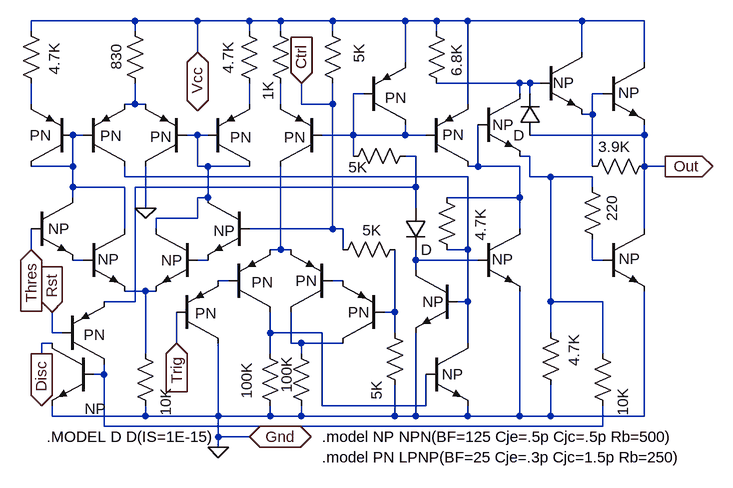
[diagram p0: schematic lm555.asc]
lm555.asc, the LTspice schematic file:
Version 4
SHEET 1 984 680
WIRE -96 144 -32 144
WIRE -32 144 -32 96
WIRE 64 16 64 48
WIRE 64 48 48 48
WIRE 64 48 80 48
WIRE -96 48 -96 16
WIRE -16 96 -32 96
WIRE 80 208 80 144
WIRE 240 48 240 16
WIRE 176 96 160 96
WIRE 160 96 160 144
WIRE 160 96 144 96
WIRE 160 144 176 144
WIRE 240 -80 160 -80
WIRE -96 -64 -96 -80
WIRE 64 -64 64 -80
WIRE 64 -80 -96 -80
WIRE 240 -64 240 -80
WIRE -32 192 -32 176
WIRE -16 288 -32 288
WIRE 48 240 48 176
WIRE 48 176 -32 176
WIRE -32 176 -32 144
WIRE 176 192 176 144
WIRE 176 144 240 144
WIRE 176 288 160 288
WIRE 96 336 80 336
WIRE 96 240 96 224
WIRE 96 224 160 224
WIRE 160 224 160 192
WIRE 160 192 176 192
WIRE 288 48 288 16
WIRE 288 -64 288 -80
WIRE 288 -80 240 -80
WIRE 240 240 368 240
WIRE 368 240 368 48
WIRE 208 320 192 320
WIRE 272 272 288 272
WIRE 288 144 288 272
WIRE 288 272 304 272
WIRE 368 320 384 320
WIRE 384 416 320 416
WIRE 304 416 304 368
WIRE 272 432 272 400
WIRE 320 432 320 416
WIRE 320 416 304 416
WIRE 192 416 192 528
WIRE 272 512 272 528
WIRE 272 528 320 528
WIRE 320 528 320 512
WIRE 272 528 192 528
WIRE 192 528 192 560
WIRE 384 272 384 240
WIRE 384 240 368 240
WIRE 464 272 464 368
WIRE 464 368 448 368
WIRE 464 400 464 368
WIRE 464 480 464 528
WIRE 464 528 320 528
WIRE 368 -64 368 -80
WIRE 368 -80 288 -80
WIRE 80 432 80 336
WIRE 80 336 48 336
WIRE 80 512 80 528
WIRE 80 528 192 528
WIRE 0 464 16 464
WIRE 16 464 16 448
WIRE -64 512 -64 528
WIRE -64 528 80 528
WIRE 272 400 352 400
WIRE 272 400 272 368
WIRE 352 400 352 512
WIRE 352 512 512 512
WIRE 512 512 512 464
WIRE 576 512 576 528
WIRE 576 528 496 528
WIRE 496 400 496 528
WIRE 496 528 464 528
WIRE 576 416 576 352
WIRE 576 352 560 352
WIRE 48 144 48 160
WIRE 48 160 576 160
WIRE 576 160 576 272
WIRE 496 208 496 176
WIRE 496 176 64 176
WIRE 64 176 64 352
WIRE 64 352 16 352
WIRE 496 304 496 288
WIRE 400 128 400 96
WIRE 352 96 400 96
WIRE 480 128 496 128
WIRE 496 128 496 176
WIRE 480 80 480 96
WIRE 480 96 400 96
WIRE 400 32 400 96
WIRE 400 32 416 32
WIRE 592 288 496 288
WIRE 496 288 496 272
WIRE 656 336 656 528
WIRE 656 528 576 528
WIRE 512 96 480 96
WIRE 544 272 576 272
WIRE 576 272 576 352
WIRE 544 192 656 192
WIRE 656 192 656 240
WIRE 480 -16 480 -80
WIRE 480 -80 368 -80
WIRE 576 144 592 144
WIRE 656 144 656 192
WIRE 576 48 576 -80
WIRE 576 -80 528 -80
WIRE 528 -64 528 -80
WIRE 528 -80 480 -80
WIRE 528 16 656 16
WIRE 752 -80 576 -80
WIRE 752 -32 752 -80
WIRE 848 144 848 96
WIRE 784 32 768 32
WIRE 768 32 768 64
WIRE 768 64 752 64
WIRE 768 144 768 64
WIRE 848 -16 848 -80
WIRE 848 -80 752 -80
WIRE 592 80 592 144
WIRE 592 144 656 144
WIRE 656 32 656 16
WIRE 656 16 672 16
WIRE 672 32 672 16
WIRE 672 16 688 16
WIRE 672 96 848 96
WIRE 848 96 848 80
WIRE 848 240 848 144
WIRE 768 176 768 160
WIRE 768 160 704 160
WIRE 672 160 672 128
WIRE 672 128 656 128
WIRE 784 288 768 288
WIRE 768 288 768 256
WIRE 704 400 704 352
WIRE 704 160 672 160
WIRE 704 480 704 528
WIRE 704 528 656 528
WIRE 704 528 848 528
WIRE 848 528 848 336
WIRE 784 432 784 352
WIRE 784 352 704 352
WIRE 704 352 704 160
WIRE 784 512 784 544
WIRE 784 544 16 544
WIRE 16 544 16 464
WIRE 192 560 240 560
WIRE 192 560 192 576
WIRE -64 416 -80 416
WIRE -48 400 -64 400
WIRE -64 400 -64 368
WIRE -96 240 -96 272
WIRE 128 368 128 416
WIRE 160 -80 160 -32
WIRE 160 -80 64 -80
WIRE 848 144 880 144
WIRE 368 48 320 48
WIRE 368 48 368 16
WIRE 320 48 320 16
WIRE -80 416 -80 432
FLAG 80 208 0
FLAG 192 576 0
FLAG 240 560 Gnd
IOPIN 240 560 BiDir
FLAG 128 416 Trig
IOPIN 128 416 In
FLAG 880 144 Out
IOPIN 880 144 Out
FLAG -64 368 Rst
IOPIN -64 368 In
FLAG 320 16 Ctrl
IOPIN 320 16 In
FLAG -96 272 Thres
IOPIN -96 272 In
FLAG -80 432 Disc
IOPIN -80 432 Out
FLAG 160 -32 Vcc
IOPIN 160 -32 BiDir
SYMBOL npn2 240 192 M0
WINDOW 0 56 32 Invisible 0
WINDOW 3 22 51 Left 0
SYMATTR InstName Q1
SYMATTR Value NP
SYMBOL npn2 -96 192 R0
WINDOW 0 56 32 Invisible 0
WINDOW 3 26 48 Left 0
SYMATTR InstName Q2
SYMATTR Value NP
SYMBOL npn2 -16 240 R0
WINDOW 0 56 32 Invisible 0
WINDOW 3 22 47 Left 0
SYMATTR InstName Q3
SYMATTR Value NP
SYMBOL npn2 160 240 M0
WINDOW 0 56 32 Invisible 0
WINDOW 3 23 48 Left 0
SYMATTR InstName Q4
SYMATTR Value NP
SYMBOL npn2 0 416 M0
WINDOW 0 56 32 Invisible 0
WINDOW 3 -19 101 Left 0
SYMATTR InstName Q5
SYMATTR Value NP
SYMBOL npn2 512 416 R0
WINDOW 0 56 32 Invisible 0
WINDOW 3 24 48 Left 0
SYMATTR InstName Q6
SYMATTR Value NP
SYMBOL pnp2 -32 144 R180
WINDOW 0 84 32 Invisible 0
WINDOW 3 33 48 Left 0
SYMATTR InstName Q7
SYMATTR Value PN
SYMBOL pnp2 -16 144 M180
WINDOW 0 84 32 Invisible 0
WINDOW 3 26 47 Left 0
SYMATTR InstName Q8
SYMATTR Value PN
SYMBOL pnp2 144 144 R180
WINDOW 0 84 32 Invisible 0
WINDOW 3 24 46 Left 0
SYMATTR InstName Q9
SYMATTR Value PN
SYMBOL pnp2 176 144 M180
WINDOW 0 84 32 Invisible 0
WINDOW 3 117 45 Left 0
SYMATTR InstName Q10
SYMATTR Value PN
SYMBOL pnp2 352 144 R180
WINDOW 0 84 32 Invisible 0
WINDOW 3 109 45 Left 0
SYMATTR InstName Q11
SYMATTR Value PN
SYMBOL res -112 -80 R0
WINDOW 0 36 40 Invisible 0
WINDOW 3 52 34 VRight 0
SYMATTR InstName R1
SYMATTR Value 4.7K
SYMATTR SpiceLine tol=1 pwr=0.1
SYMBOL res 48 -80 R0
WINDOW 0 36 40 Invisible 0
WINDOW 3 -13 35 VRight 0
SYMATTR InstName R2
SYMATTR Value 830
SYMATTR SpiceLine tol=1 pwr=0.1
SYMBOL res 224 -80 R0
WINDOW 0 36 40 Invisible 0
WINDOW 3 -17 32 VRight 0
SYMATTR InstName R3
SYMATTR Value 4.7K
SYMATTR SpiceLine tol=1 pwr=0.1
SYMBOL res 272 -80 R0
WINDOW 0 36 40 Invisible 0
WINDOW 3 -3 93 VRight 0
SYMATTR InstName R4
SYMATTR Value 1K
SYMATTR SpiceLine tol=1 pwr=0.1
SYMBOL res 352 -80 R0
WINDOW 0 36 40 Invisible 0
WINDOW 3 57 35 VRight 0
SYMATTR InstName R5
SYMATTR Value 5K
SYMATTR SpiceLine tol=1 pwr=0.1
SYMBOL res 512 -80 R0
WINDOW 0 36 40 Invisible 0
WINDOW 3 47 36 VRight 0
SYMATTR InstName R6
SYMATTR Value 6.8K
SYMATTR SpiceLine tol=1 pwr=0.1
SYMBOL pnp2 128 416 M180
WINDOW 0 84 32 Invisible 0
WINDOW 3 28 46 Left 0
SYMATTR InstName Q13
SYMATTR Value PN
SYMBOL pnp2 208 368 M180
WINDOW 0 84 32 Invisible 0
WINDOW 3 35 46 Left 0
SYMATTR InstName Q14
SYMATTR Value PN
SYMBOL pnp2 368 368 R180
WINDOW 0 84 32 Invisible 0
WINDOW 3 24 48 Left 0
SYMATTR InstName Q15
SYMATTR Value PN
SYMBOL pnp2 448 416 R180
WINDOW 0 84 32 Invisible 0
WINDOW 3 23 48 Left 0
SYMATTR InstName Q16
SYMATTR Value PN
SYMBOL res 256 416 R0
WINDOW 0 36 40 Invisible 0
WINDOW 3 -20 29 VRight 0
SYMATTR InstName R7
SYMATTR Value 100K
SYMATTR SpiceLine tol=1 pwr=0.1
SYMBOL res 304 416 R0
WINDOW 0 36 40 Invisible 0
WINDOW 3 -7 20 VRight 0
SYMATTR InstName R8
SYMATTR Value 100K
SYMATTR SpiceLine tol=1 pwr=0.1
SYMBOL res 480 256 R90
WINDOW 0 36 40 Invisible 0
WINDOW 3 -14 37 VRight 0
SYMATTR InstName R9
SYMATTR Value 5K
SYMATTR SpiceLine tol=1 pwr=0.1
SYMBOL res 448 384 R0
WINDOW 0 36 40 Invisible 0
WINDOW 3 -12 90 VRight 0
SYMATTR InstName R10
SYMATTR Value 5K
SYMATTR SpiceLine tol=1 pwr=0.1
SYMBOL res 64 416 R0
WINDOW 0 36 40 Invisible 0
WINDOW 3 47 69 VRight 0
SYMATTR InstName R11
SYMATTR Value 10K
SYMATTR SpiceLine tol=1 pwr=0.1
SYMBOL pnp2 -48 448 M180
WINDOW 0 84 32 Invisible 0
WINDOW 3 33 45 Left 0
SYMATTR InstName Q17
SYMATTR Value PN
SYMBOL npn2 560 304 M0
WINDOW 0 56 32 Invisible 0
WINDOW 3 21 48 Left 0
SYMATTR InstName Q18
SYMATTR Value NP
SYMBOL res 496 112 R90
WINDOW 0 36 40 Invisible 0
WINDOW 3 33 74 VRight 0
SYMATTR InstName R12
SYMATTR Value 5K
SYMATTR SpiceLine tol=1 pwr=0.1
SYMBOL pnp2 416 80 M180
WINDOW 0 84 32 Invisible 0
WINDOW 3 33 42 Left 0
SYMATTR InstName Q19
SYMATTR Value PN
SYMBOL pnp2 512 144 M180
WINDOW 0 84 32 Invisible 0
WINDOW 3 25 49 Left 0
SYMATTR InstName Q20
SYMATTR Value PN
SYMBOL npn2 592 240 R0
WINDOW 0 56 32 Invisible 0
WINDOW 3 21 47 Left 0
SYMATTR InstName Q21
SYMATTR Value NP
SYMBOL res 560 288 R180
WINDOW 0 36 40 Invisible 0
WINDOW 3 -36 29 VRight 0
SYMATTR InstName R13
SYMATTR Value 4.7K
SYMATTR SpiceLine tol=1 pwr=0.1
SYMBOL npn2 688 -32 R0
WINDOW 0 56 32 Invisible 0
WINDOW 3 19 47 Left 0
SYMATTR InstName Q22
SYMATTR Value NP
SYMBOL npn2 592 32 R0
WINDOW 0 56 32 Invisible 0
WINDOW 3 22 48 Left 0
SYMATTR InstName Q23
SYMATTR Value NP
SYMBOL npn2 784 -16 R0
WINDOW 0 56 32 Invisible 0
WINDOW 3 24 47 Left 0
SYMATTR InstName Q24
SYMATTR Value NP
SYMBOL res 864 128 R90
WINDOW 0 36 40 Invisible 0
WINDOW 3 -14 37 VRight 0
SYMATTR InstName R14
SYMATTR Value 3.9K
SYMATTR SpiceLine tol=1 pwr=0.1
SYMBOL npn2 784 240 R0
WINDOW 0 56 32 Invisible 0
WINDOW 3 25 46 Left 0
SYMATTR InstName Q25
SYMATTR Value NP
SYMBOL res 784 272 R180
WINDOW 0 36 40 Invisible 0
WINDOW 3 -14 43 VRight 0
SYMATTR InstName R15
SYMATTR Value 220
SYMATTR SpiceLine tol=1 pwr=0.1
SYMBOL res 720 496 R180
WINDOW 0 36 40 Invisible 0
WINDOW 3 -20 44 VRight 0
SYMATTR InstName R16
SYMATTR Value 4.7K
SYMATTR SpiceLine tol=1 pwr=0.1
SYMBOL res 768 416 R0
WINDOW 0 36 40 Invisible 0
WINDOW 3 47 69 VRight 0
SYMATTR InstName R17
SYMATTR Value 10K
SYMATTR SpiceLine tol=1 pwr=0.1
SYMBOL diode 688 96 R180
WINDOW 0 24 72 Invisible 0
WINDOW 3 24 0 Left 0
SYMATTR InstName D2
SYMBOL diode 480 208 R0
WINDOW 0 24 0 Invisible 0
SYMATTR InstName D1
TEXT 352 560 Left 0 !.model NP NPN(BF=125 Cje=.5p Cjc=.5p Rb=500)\n.model PN LPNP(BF=25 Cje=.3p Cjc=1.5p Rb=250)
TEXT -72 560 Left 0 !.MODEL D D(IS=1E-15)

The netlist it stands for:
* lm555.asc
Q1 N005 Ctrl N007 0 NP
Q2 N001 Thres N006 0 NP
Q3 N001 N006 N008 0 NP
Q4 N005 N007 N008 0 NP
Q5 Disc N016 0 0 NP
Q6 N017 N014 0 0 NP
Q7 N001 N001 N003 0 PN
Q8 N017 N001 N002 0 PN
Q9 0 N005 N002 0 PN
Q10 N005 N005 N004 0 PN
Q11 N011 N020 N009 0 PN
R1 Vcc N003 4.7K tol=1 pwr=0.1
R2 Vcc N002 830 tol=1 pwr=0.1
R3 Vcc N004 4.7K tol=1 pwr=0.1
R4 Vcc N009 1K tol=1 pwr=0.1
R5 Vcc Ctrl 5K tol=1 pwr=0.1
R6 Vcc N022 6.8K tol=1 pwr=0.1
Q13 0 Trig N010 0 PN
Q14 N014 N010 N011 0 PN
Q15 N013 N012 N011 0 PN
Q16 N013 N015 N012 0 PN
R7 N014 0 100K tol=1 pwr=0.1
R8 N013 0 100K tol=1 pwr=0.1
R9 N015 Ctrl 5K tol=1 pwr=0.1
R10 N015 0 5K tol=1 pwr=0.1
R11 N008 0 10K tol=1 pwr=0.1
Q17 N016 Rst N018 0 PN
Q18 N019 N017 0 0 NP
R12 N018 N020 5K tol=1 pwr=0.1
Q19 N020 N020 Vcc 0 PN
Q20 N021 N020 Vcc 0 PN
Q21 N021 N019 0 0 NP
R13 N017 N021 4.7K tol=1 pwr=0.1
Q22 Vcc N022 N023 0 NP
Q23 N022 N021 N024 0 NP
Q24 Vcc N023 Out 0 NP
R14 Out N023 3.9K tol=1 pwr=0.1
Q25 Out N025 0 0 NP
R15 N025 N024 220 tol=1 pwr=0.1
R16 0 N024 4.7K tol=1 pwr=0.1
R17 N024 N016 10K tol=1 pwr=0.1
D2 Out N022 D
D1 N018 N019 D
.model D D
.lib standard.dio
.model NPN NPN
.model PNP PNP
.lib standard.bjt
.model NP NPN(BF=125 Cje=.5p Cjc=.5p Rb=500)
.model PN LPNP(BF=25 Cje=.3p Cjc=1.5p Rb=250)
.MODEL D D(IS=1E-15)
.backanno
.end